# Altium schematic sheet Trace_3.SchDoc
size A4; SheetNumber: 1; SheetTotal: 1
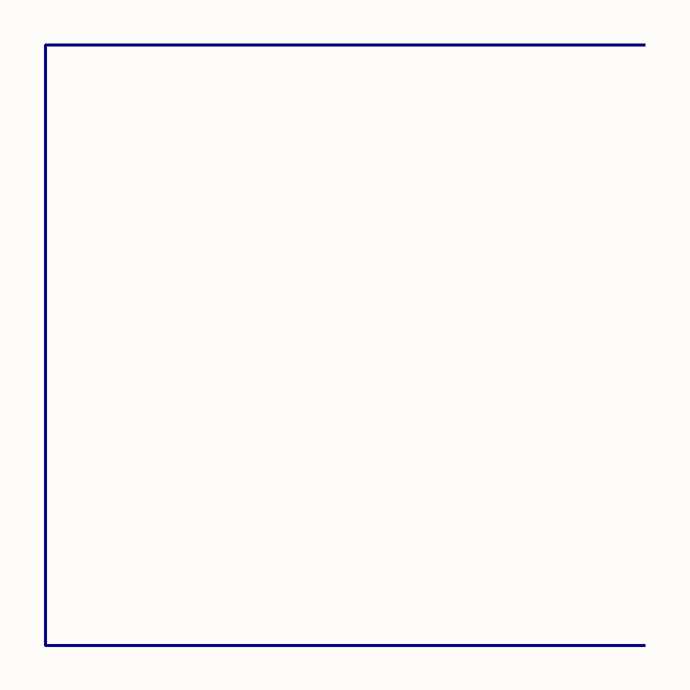
[diagram p0: Trace_3.SchDoc]